# Altium schematic sheet Iso_Current_Limit.SchDoc: Current Limiter
size A3; DocumentNumber: 6; SheetNumber: 6; SheetTotal: 19
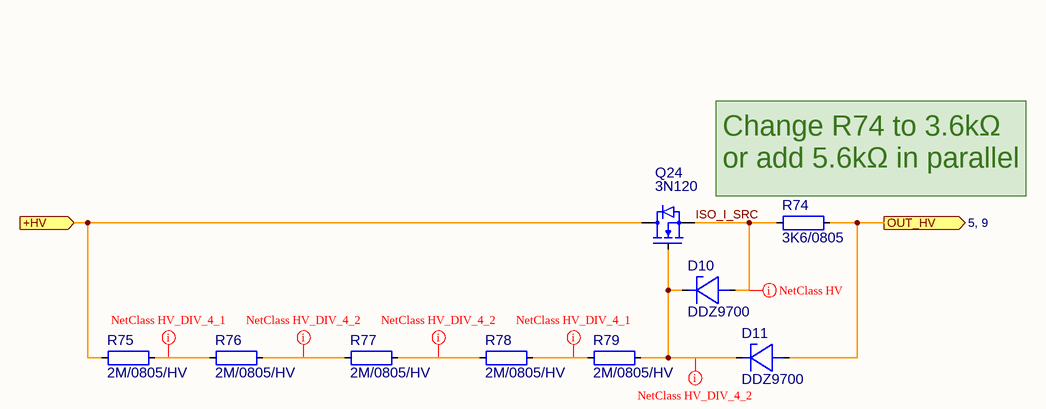
[diagram p0: Iso_Current_Limit.SchDoc]

## Parts
D10  DDZ9700  [SOD3718X125]
D11  DDZ9700  [SOD3718X125]
Q24  3N120  [TO228P990X229-3]
R74  3K6/0805  [R0805-0.50-WW]
R75  2M/0805/HV  [R0805-0.50-HV-WW]
R76  2M/0805/HV  [R0805-0.50-HV-WW]
R77  2M/0805/HV  [R0805-0.50-HV-WW]
R78  2M/0805/HV  [R0805-0.50-HV-WW]
R79  2M/0805/HV  [R0805-0.50-HV-WW]

## Ports
+HV (in), OUT_HV (out, see 5, 9)

## Nets
+HV: Q24.3(DRAIN) R75.2 ; port +HV
ISO_I_SRC: D10.2(A) Q24.2(SOURCE) R74.1
OUT_HV: D11.2(A) R74.2 ; port OUT_HV
NetD10_1: D10.1(C) D11.1(C) Q24.1(GATE) R79.2
NetR75_1: R75.1 R76.2
NetR76_1: R76.1 R77.2
NetR77_1: R77.1 R78.2
NetR78_1: R78.1 R79.1

## Layout directives
net class HV_DIV_4_1: NetR75_1, NetR78_1
net class HV_DIV_4_2: NetD10_1, NetR76_1, NetR77_1
net class HV: ISO_I_SRC

## Notes on the sheet
- TO-220 option: IXTP3N120
- (near Q24) Alternative:
  CMD3N120 (C49208270)
- Change R74 to 3.6kΩ
  or add 5.6kΩ in parallel
- Date:
- Size:
- A3
- Schema:
- Layout:

## Library data of the parts
D10 D11 = DDZ9700: Low current zener diode 13V 500mW SOD123; Manufacturer: Diodes Incorporated; Manufacturer Part Number 1: DDZ9700-7; Part Number: DDZ9700; Package: SOD-123; Value: 13V; Absolute Value: 13V; HelpURL: https://www.diodes.com/datasheet/download/DDZ96xx-DDZ97xx.pdf; Manufacturer 1: Diodes Incorporated; Supplier 1: Digikey; Supplier Part Number 1: 31-DDZ9700-7CT-ND; Manufacturer 3: DIODES; Manufacturer Part Number 3: DDZ9700-7; Supplier 3: LCSC; Supplier Part Number 3: C460862; JLC Type: Extended
Q24 = 3N120: N-Channel MOSFET 1200V; Manufacturer: Tech Public; Part Number: 3N120; Package: TO-252AA; HelpURL: https://www.lcsc.com/datasheet/C42437012.pdf; Manufacturer 3: TECH PUBLIC; Manufacturer Part Number 3: 3N120; Supplier 3: LCSC; Supplier Part Number 3: C42437012; JLC Type: Extended
R74 = 3K6/0805: RES SM 0805 3K6; Manufacturer: GENERIC; Manufacturer 1: YAGEO; Manufacturer Part Number 1: RC0805FR-133K6L; Absolute Value: 3600; Eurocircuits GPN: GPR08053K6; Part Number: 3K6/0805; Package: 0805; Value: 3K6; HelpURL: https://www.yageogroup.com/content/datasheet/asset/file/PYU-RC_GROUP_51_ROHS_L; Supplier 1: Digi-Key; Supplier Part Number 1: 13-RC0805FR-133K6LCT-ND; Manufacturer 2: YAGEO; Manufacturer Part Number 2: RC0805FR-073K6L; Supplier 2: Digi-Key; Supplier Part Number 2: 311-3.60KCRCT-ND
R75-R79 = 2M/0805/HV: RES SM 0805 2M High voltage; Manufacturer: GENERIC; Manufacturer 1: YAGEO; Manufacturer Part Number 1: RV0805FR-072ML; Absolute Value: 2000000; Part Number: 2M/0805/HV; Package: 0805; Value: 2M; HelpURL: https://www.yageogroup.com/content/datasheet/asset/file/PYU-RV_51_ROHS_L; Supplier 1: Digi-Key; Supplier Part Number 1: 13-RV0805FR-072MLCT-ND; JLC Type: Extended; Manufacturer 3: YAGEO; Manufacturer Part Number 3: RV0805FR-072ML; Supplier 3: LCSC; Supplier Part Number 3: C873372